# EasyEDA Pro project ProPrj_Hitboard PCB v2_center_2026-01-14.epro

# Board PCB1
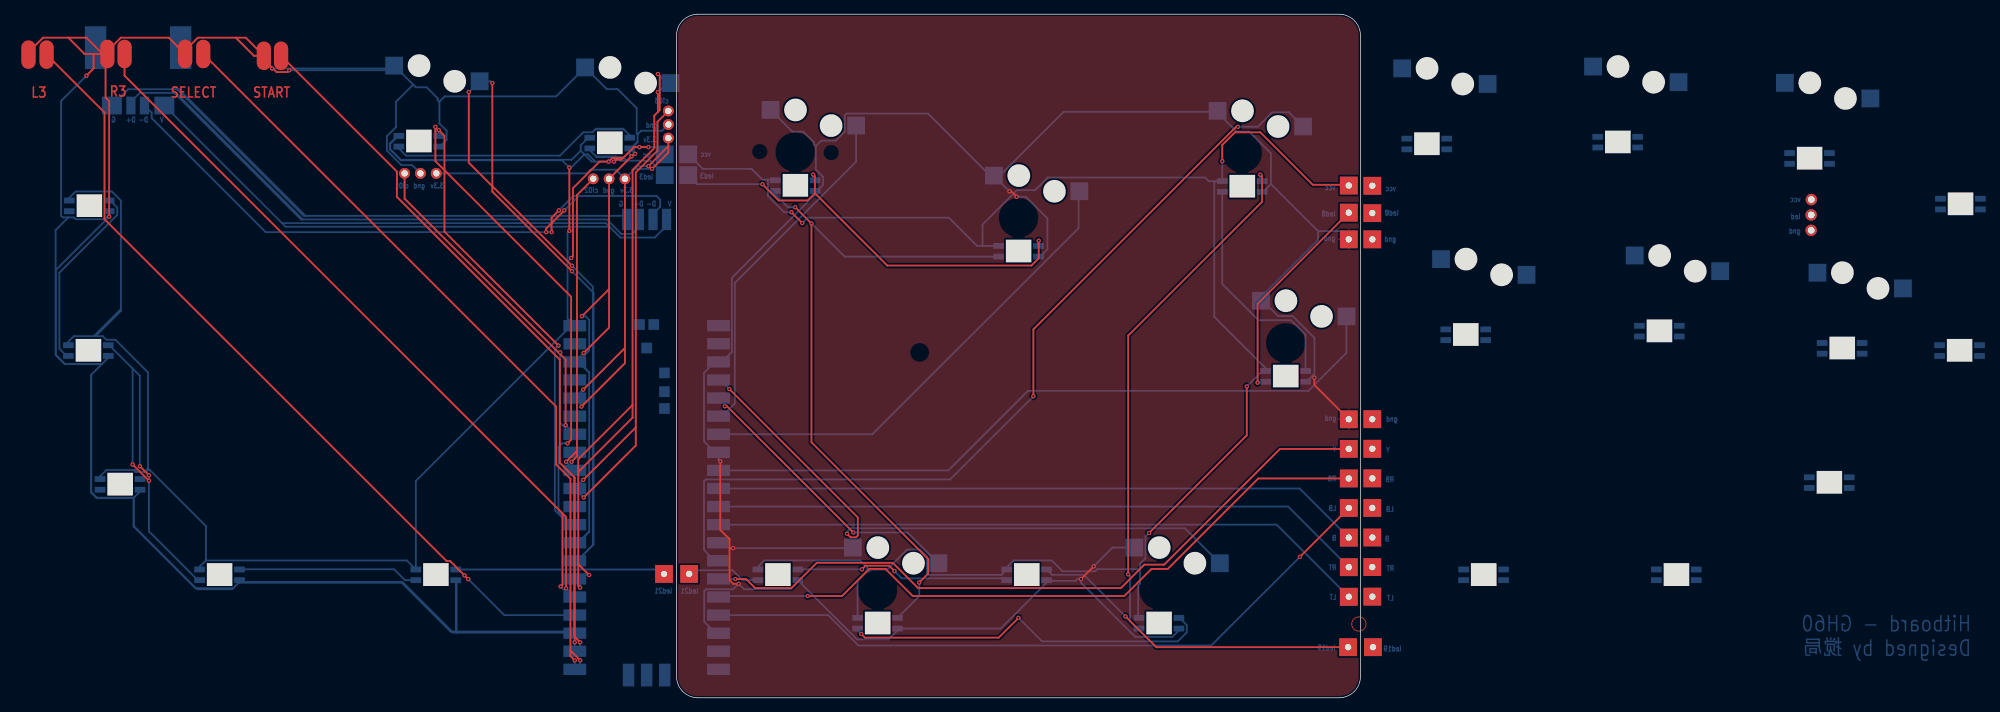
[diagram p0: board, top side]
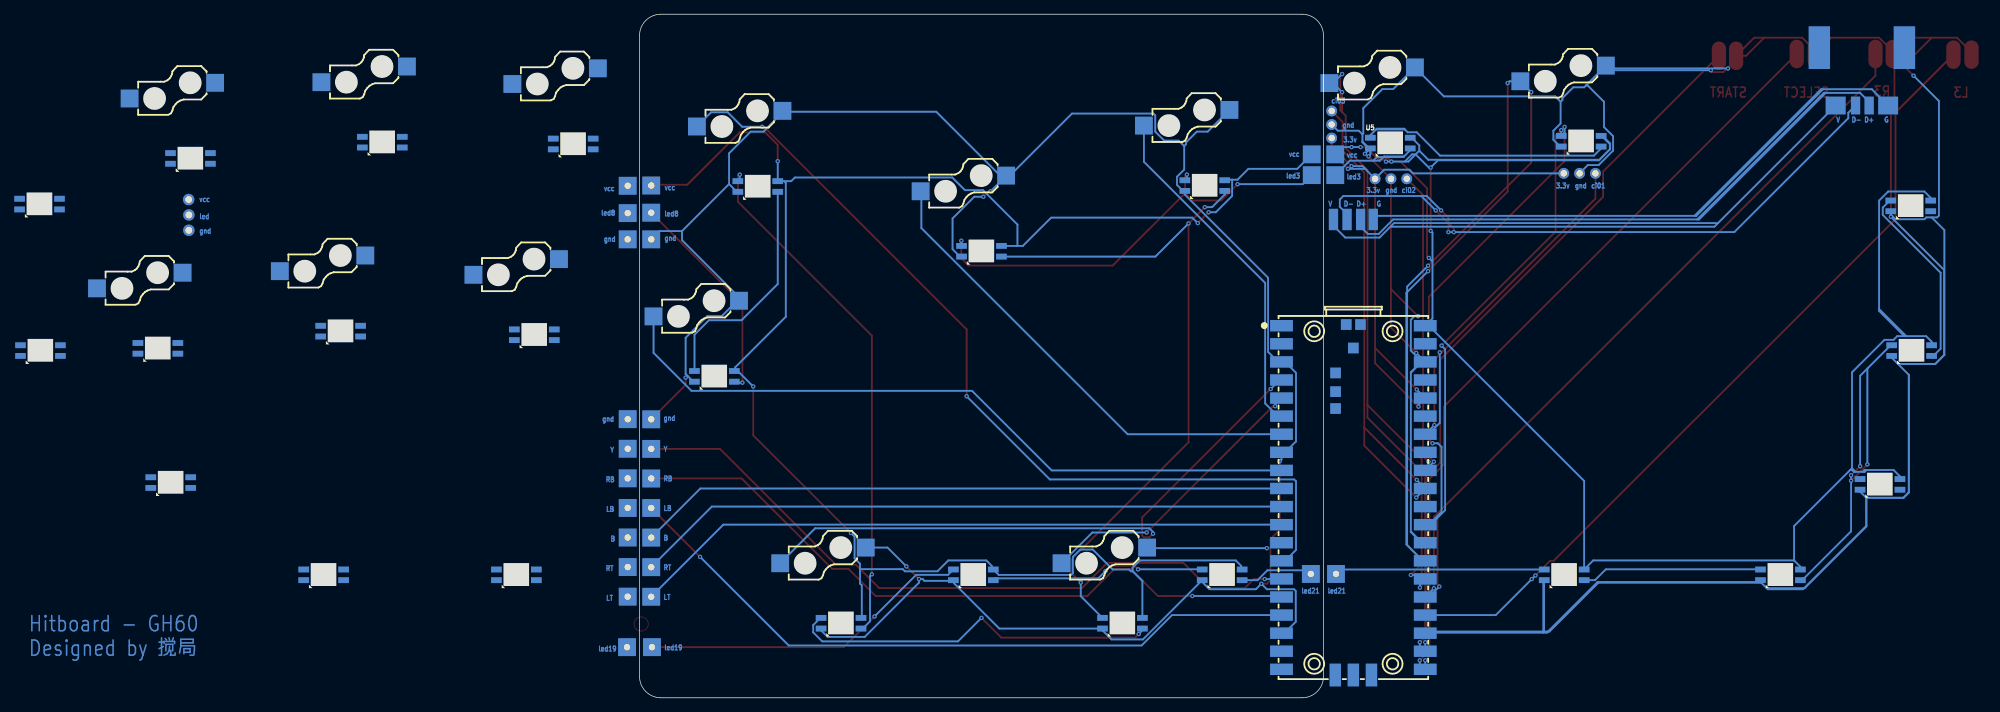
[diagram p1: board, bottom side, seen from below]

Outline 266.36 x 96 mm; copper layers: Top Layer, Bottom Layer. Coordinates in mm from the lower left corner of the outline.
Outline path: 84.34,93 84.34,3 arc(85.22,0.88) 87.34,0 177.34,0 arc(179.46,0.88) 180.34,3 180.34,93 arc(179.46,95.12) 177.34,96 87.34,96 arc(85.22,95.12) 84.34,93
Stack: Top Layer 0.035mm / Dielectric1 1.51mm FR4 er 4.5 / Bottom Layer 0.035mm

## Design rules (mm)
template: JLCPCB Capability(Two Layers Board)
spacing copperThickness1oz (default): track to track 0.102, other pairs 0.152 to 0.3
spacing copperThickness2oz: track to track 0.203, other pairs 0.152 to 0.3
track width copperThickness1oz (default): min 0.127, default 0.254, max 2.54
track width copperThickness2oz: min 0.203, default 0.254, max 2.54
differential pair differentialPair (default): width min 0.127, default 0.254, max 2.54; gap min 0.152, default 0.152
via viaSize (default): diameter min 0.5, default 0.61, max 10; hole min 0.3, default 0.305, max 6.3

## Placement (name value [footprint] x y rotation side)
NOREF  -  [Pad_e53994]  14.74 91.31 180 top
NOREF#2  -  [Pad_e677]  4.45 90.42 0 top
NOREF#3  -  [Pad_e300]  83.19 80.51 0 top
NOREF#4  -  [Pad_e295]  50.62 73.65 0 top
NOREF#5  -  [Pad_e13607]  178.69 18.34 0 top
NOREF#6  -  [Pad_e682]  28.84 90.16 0 top
NOREF#7  -  [Pad_e13636]  182 64.38 0 top
NOREF#8  -  [Pad_e13604]  178.69 30.8 0 top
NOREF#9  -  [Pad_e70]  182 30.82 0 top
NOREF#10  -  [Pad_e61147]  243.59 67.81 0 top
NOREF#11  -  [Pad_e689]  77.35 67.18 180 top
NOREF#12  -  [Pad_e679]  15.37 90.42 0 top
NOREF#13  -  [Pad_e68]  182 39.13 0 top
NOREF#14  -  [Pad_e680]  17.91 90.42 0 top
NOREF#15  -  [Pad_e301]  83.19 82.42 0 top
NOREF#16  -  [Pad_e686]  12.45 83.18 180 top
NOREF#17  -  [Pad_e299]  83.19 78.61 0 top
NOREF#18  -  [Pad_e13635]  182 68.07 0 top
NOREF#19  -  [Pad_e687]  85.98 76.32 0 top
NOREF#20  -  [Pad_e6736]  82.68 76.32 0 top
NOREF#21  -  [Pad_e53995]  2.8 91.31 180 top
NOREF#22  -  [Pad_e4877]  178.59 7.11 0 top
NOREF#23  -  [Pad_e13606]  178.69 22.49 0 top
NOREF#24  -  [Pad_e114539]  178.69 39.11 0 top
NOREF#25  -  [Pad_e675]  -6.62 90.33 0 top
NOREF#26  -  [Pad_e294]  74.87 72.89 0 top
NOREF#27  -  [Pad_e681]  26.42 90.16 0 top
NOREF#28  -  [Pad_e685]  9.66 83.18 180 top
NOREF#29  -  [Pad_e676]  -4.08 90.33 0 top
NOREF#30  -  [Pad_e61146]  243.62 69.97 0 top
NOREF#31  -  [Pad_e693]  81.03 67.18 180 top
NOREF#32  -  [Pad_e71]  182 26.66 0 top
NOREF#33  -  [Pad_e72]  182 22.51 0 top
NOREF#34  -  [Pad_e678]  6.86 90.42 0 top
NOREF#35  -  [Pad_e69]  182 34.97 0 top
NOREF#36  -  [Pad_e297]  46.17 73.65 0 top
NOREF#37  -  [Pad_e13602]  178.69 64.38 0 top
NOREF#38  -  [Pad_e684]  7.75 83.18 180 top
NOREF#39  -  [Pad_e74]  182 14.2 0 top
NOREF#40  -  [Pad_e296]  48.39 73.65 0 top
NOREF#41  -  [Pad_e694]  82.94 67.18 180 top
NOREF#42  -  [Pad_e4875]  182.09 7.11 0 top
NOREF#43  -  [Pad_e4881]  86.11 17.39 0 top
NOREF#44  -  [Pad_e6738]  82.68 73.4 0 top
NOREF#45  -  [Pad_e13603]  178.69 34.96 0 top
NOREF#46  -  [Pad_e691]  79.13 67.18 180 top
NOREF#47  -  [Pad_e6737]  85.98 73.4 0 top
NOREF#48  -  [Pad_e13605]  178.69 26.65 0 top
NOREF#49  -  [Pad_e13637]  182 71.91 0 top
NOREF#50  -  [Pad_e13608]  178.69 14.19 0 top
NOREF#51  -  [Pad_e73]  182 18.36 0 top
NOREF#52  -  [Pad_e46]  77.09 72.89 0 top
NOREF#53  -  [Pad_e13600]  178.69 71.94 0 top
NOREF#54  -  [Pad_e683]  5.09 83.18 180 top
NOREF#55  -  [Pad_e13601]  178.69 68.13 0 top
NOREF#56  -  [Pad_e61148]  243.59 65.65 0 top
NOREF#57  -  [Pad_e4879]  82.58 17.39 0 top
NOREF#58  -  [Pad_e48]  72.65 72.89 0 top
U1  PICO  [COMM-SMD_L51.0-W21.0-P2.54_SC0916]  80.14 27.81 270 bottom
U5  -  [LED-SMD_L3.2-W2.8_YO-WS2812B-3528]  132.34 62.71 180 bottom
U5#2  -  [LED-SMD_L3.2-W2.8_YO-WS2812B-3528]  264.55 69.34 180 bottom
U5#3  -  [LED-SMD_L3.2-W2.8_YO-WS2812B-3528]  264.42 48.76 180 bottom
U5#4  -  [LED-SMD_L3.2-W2.8_YO-WS2812B-3528]  246.13 30.22 180 bottom
U5#5  -  [LED-SMD_L3.2-W2.8_YO-WS2812B-3528]  197.62 17.27 180 bottom
U5#6  -  [LED-SMD_L3.2-W2.8_YO-WS2812B-3528]  133.48 17.27 180 bottom
U5#7  -  [LED-SMD_L3.2-W2.8_YO-WS2812B-3528]  98.56 17.27 180 bottom
U5#8  -  [LED-SMD_L3.2-W2.8_YO-WS2812B-3528]  50.55 17.27 180 bottom
U5#9  -  [LED-SMD_L3.2-W2.8_YO-WS2812B-3528]  20.2 17.27 180 bottom
U5#10  -  [LED-SMD_L3.2-W2.8_YO-WS2812B-3528]  1.78 48.76 180 bottom
U5#11  -  [LED-SMD_L3.2-W2.8_YO-WS2812B-3528]  1.91 69.08 180 bottom
U5#12  -  [LED-SMD_L3.2-W2.8_YO-WS2812B-3528]  6.23 29.97 180 bottom
U5#13  -  [LED-SMD_L3.2-W2.8_YO-WS2812B-3528]  224.67 17.27 180 bottom
U5#14  -  [LED-SMD_L3.2-W2.8_YO-WS2812B-3528]  48.17 78.16 180 bottom
U5#15  -  [LED-SMD_L3.2-W2.8_YO-WS2812B-3528]  74.96 77.91 180 bottom
U5#16  -  [LED-SMD_L3.2-W2.8_YO-WS2812B-3528]  101 71.94 180 bottom
U5#17  -  [LED-SMD_L3.2-W2.8_YO-WS2812B-3528]  112.56 10.47 180 bottom
U5#18  -  [LED-SMD_L3.2-W2.8_YO-WS2812B-3528]  152.05 10.47 180 bottom
U5#19  -  [LED-SMD_L3.2-W2.8_YO-WS2812B-3528]  163.74 71.81 180 bottom
U5#20  -  [LED-SMD_L3.2-W2.8_YO-WS2812B-3528]  169.83 45.14 180 bottom
U5#21  -  [LED-SMD_L3.2-W2.8_YO-WS2812B-3528]  189.64 77.78 180 bottom
U5#22  -  [LED-SMD_L3.2-W2.8_YO-WS2812B-3528]  195.11 50.98 180 bottom
U5#23  -  [LED-SMD_L3.2-W2.8_YO-WS2812B-3528]  216.44 78.03 180 bottom
U5#24  -  [LED-SMD_L3.2-W2.8_YO-WS2812B-3528]  222.28 51.49 180 bottom
U5#25  -  [LED-SMD_L3.2-W2.8_YO-WS2812B-3528]  243.37 75.75 180 bottom
U5#26  -  [LED-SMD_L3.2-W2.8_YO-WS2812B-3528]  247.94 49.08 180 bottom
U6  -  [CONN-SMD_HOTPLUGPAKAGE__C9900010116-1]  103.54 81.46 180 bottom
U6#2  -  [CONN-SMD_HOTPLUGPAKAGE__C9900010116-1]  134.88 72.24 180 bottom
U6#3  -  [CONN-SMD_HOTPLUGPAKAGE__C9900010116-1]  50.71 87.68 180 bottom
U6#4  -  [CONN-SMD_HOTPLUGPAKAGE__C9900010116-1]  77.5 87.43 180 bottom
U6#5  -  [CONN-SMD_HOTPLUGPAKAGE__C9900010116-1]  115.1 19.99 180 bottom
U6#6  -  [CONN-SMD_HOTPLUGPAKAGE__C9900010116-1]  154.59 19.99 180 bottom
U6#7  -  [CONN-SMD_HOTPLUGPAKAGE__C9900010116-1]  166.28 81.33 180 bottom
U6#8  -  [CONN-SMD_HOTPLUGPAKAGE__C9900010116-1]  172.37 54.66 180 bottom
U6#9  -  [CONN-SMD_HOTPLUGPAKAGE__C9900010116-1]  192.18 87.3 180 bottom
U6#10  -  [CONN-SMD_HOTPLUGPAKAGE__C9900010116-1]  197.65 60.51 180 bottom
U6#11  -  [CONN-SMD_HOTPLUGPAKAGE__C9900010116-1]  218.98 87.56 180 bottom
U6#12  -  [CONN-SMD_HOTPLUGPAKAGE__C9900010116-1]  224.82 61.01 180 bottom
U6#13  -  [CONN-SMD_HOTPLUGPAKAGE__C9900010116-1]  245.91 85.27 180 bottom
U6#14  -  [CONN-SMD_HOTPLUGPAKAGE__C9900010116-1]  250.48 58.6 180 bottom

## Footprints (pads in the part's own frame, mm; a bottom-side part is the same pattern mirrored in y, then rotated)
COMM-SMD_L51.0-W21.0-P2.54_SC0916
  rect 1.6x3.2 smd: 1(-24.445,-10.088) 2(-21.905,-10.088) 3(-19.365,-10.088) 4(-16.825,-10.088) 5(-14.285,-10.088) 6(-11.745,-10.088) 7(-9.205,-10.088) 8(-6.665,-10.088) 9(-4.125,-10.088) 10(-1.585,-10.088) 11(0.955,-10.088) 12(3.495,-10.088) 13(6.035,-10.088) 14(8.575,-10.088) 15(11.115,-10.088) 16(13.655,-10.088) 17(16.195,-10.088) 18(18.735,-10.088) 19(21.275,-10.088) 20(23.815,-10.088) 21(23.815,10.088) 22(21.275,10.088) 23(18.735,10.088) 24(16.195,10.088) 25(13.655,10.088) 26(11.115,10.088) 27(8.575,10.088) 28(6.035,10.088) 29(3.495,10.088) 30(0.955,10.088) 31(-1.585,10.088) 32(-4.125,10.088) 33(-6.665,10.088) 34(-9.205,10.088) 35(-11.745,10.088) 36(-14.285,10.088) 37(-16.825,10.088) 38(-19.365,10.088) 39(-21.905,10.088) 40(-24.445,10.088)
  rect 3.2x1.6 smd: 41(24.615,-2.54) 42(24.615,0) 43(24.615,2.54)
  rect 1.5x1.5 smd: TP1(-21.315,0) TP2(-24.615,1) TP3(-24.615,-1) TP4(-17.815,-2.5) TP5(-15.188,-2.5) TP6(-12.815,-2.5)
CONN-SMD_HOTPLUGPAKAGE__C9900010116-1
  rect 2.5x2.5 smd: 1(-6,-1.1) 2(6,1.1)
LED-SMD_L3.2-W2.8_YO-WS2812B-3528
  rect 1.5x0.82 smd: 1(2.8,0.75) 2(2.8,-0.75) 3(-2.8,-0.75) 4(-2.8,0.75)
Pad_e46
  round 1.524 hole 0.914: 1(0,0)
Pad_e48
  round 1.524 hole 0.914: 1(0,0)
Pad_e68
  rect 2.5x2.5 hole 0.9: PTH(0,0)
Pad_e69
  rect 2.5x2.5 hole 0.9: PTH(0,0)
Pad_e70
  rect 2.5x2.5 hole 0.9: PTH(0,0)
Pad_e71
  rect 2.5x2.5 hole 0.9: PTH(0,0)
Pad_e72
  rect 2.5x2.5 hole 0.9: PTH(0,0)
Pad_e73
  rect 2.5x2.5 hole 0.9: PTH(0,0)
Pad_e74
  rect 2.5x2.5 hole 0.9: PTH(0,0)
Pad_e294
  round 1.524 hole 0.914: 1(0,0)
Pad_e295
  round 1.524 hole 0.914: 1(0,0)
Pad_e296
  round 1.524 hole 0.914: 1(0,0)
Pad_e297
  round 1.524 hole 0.914: 1(0,0)
Pad_e299
  round 1.524 hole 0.914: 1(0,0)
Pad_e300
  round 1.524 hole 0.914: 1(0,0)
Pad_e301
  round 1.524 hole 0.914: 1(0,0)
Pad_e675
  oval 2x4 smd: 1(0,0)
Pad_e676
  oval 2x4 smd: 1(0,0)
Pad_e677
  oval 2x4 smd: 1(0,0)
Pad_e678
  oval 2x4 smd: 1(0,0)
Pad_e679
  oval 2x4 smd: 1(0,0)
Pad_e680
  oval 2x4 smd: 1(0,0)
Pad_e681
  oval 2x4 smd: 1(0,0)
Pad_e682
  oval 2x4 smd: 1(0,0)
Pad_e683
  rect 2.8x2.5 smd far side: PTH(0,0)
Pad_e684
  rect 1.3x2.5 smd far side: PTH(0,0)
Pad_e685
  rect 1.3x2.5 smd far side: PTH(0,0)
Pad_e686
  rect 2.8x2.5 smd far side: PTH(0,0)
Pad_e687
  rect 2.5x2.5 smd far side: PTH(0,0)
Pad_e689
  rect 1.3x3 smd far side: PTH(0,0)
Pad_e691
  rect 1.3x3 smd far side: PTH(0,0)
Pad_e693
  rect 1.3x3 smd far side: PTH(0,0)
Pad_e694
  rect 1.3x3 smd far side: PTH(0,0)
Pad_e4875
  rect 2.5x2.5 hole 0.9: PTH(0,0)
Pad_e4877
  rect 2.5x2.5 hole 0.9: PTH(0,0)
Pad_e4879
  rect 2.5x2.5 hole 0.9: PTH(0,0)
Pad_e4881
  rect 2.5x2.5 hole 0.9: PTH(0,0)
Pad_e6736
  rect 2.5x2.5 smd far side: PTH(0,0)
Pad_e6737
  rect 2.5x2.5 smd far side: PTH(0,0)
Pad_e6738
  rect 2.5x2.5 smd far side: PTH(0,0)
Pad_e13600
  rect 2.5x2.5 hole 0.9: PTH(0,0)
Pad_e13601
  rect 2.5x2.5 hole 0.9: PTH(0,0)
Pad_e13602
  rect 2.5x2.5 hole 0.9: PTH(0,0)
Pad_e13603
  rect 2.5x2.5 hole 0.9: PTH(0,0)
Pad_e13604
  rect 2.5x2.5 hole 0.9: PTH(0,0)
Pad_e13605
  rect 2.5x2.5 hole 0.9: PTH(0,0)
Pad_e13606
  rect 2.5x2.5 hole 0.9: PTH(0,0)
Pad_e13607
  rect 2.5x2.5 hole 0.9: PTH(0,0)
Pad_e13608
  rect 2.5x2.5 hole 0.9: PTH(0,0)
Pad_e13635
  rect 2.5x2.5 hole 0.9: PTH(0,0)
Pad_e13636
  rect 2.5x2.5 hole 0.9: PTH(0,0)
Pad_e13637
  rect 2.5x2.5 hole 0.9: PTH(0,0)
Pad_e53994
  rect 3x6 smd far side: PTH(0,0)
Pad_e53995
  rect 3x6 smd far side: PTH(0,0)
Pad_e61146
  round 1.6 hole 0.96: PTH(0,0)
Pad_e61147
  round 1.6 hole 0.96: PTH(0,0)
Pad_e61148
  round 1.6 hole 0.96: PTH(0,0)
Pad_e114539
  rect 2.5x2.5 hole 0.9: PTH(0,0)

## Nets
3V3: NOREF#4.1 NOREF#17.1 NOREF#52.1 U1.36
GND: NOREF#2.1 NOREF#3.1 NOREF#7.PTH NOREF#12.1 NOREF#13.PTH NOREF#24.PTH NOREF#25.1 NOREF#26.1 NOREF#27.1 NOREF#37.PTH NOREF#40.1 NOREF#56.PTH U1.3 U1.8 U1.18 U1.23 U1.28 U1.38 U5.3 U5#2.3 U5#3.3 U5#4.3 U5#5.3 U5#6.3 U5#7.3 U5#8.3 U5#9.3 U5#10.3 U5#11.3 U5#12.3 U5#13.3 U5#14.3 U5#15.3 U5#16.3 U5#17.3 U5#18.3 U5#19.3 U5#20.3 U5#21.3 U5#22.3 U5#23.3 U5#24.3 U5#25.3 U5#26.3 U6.2 U6#2.2 U6#3.2 U6#4.2 U6#5.2 U6#6.2 U6#7.2 U6#8.2 U6#9.2 U6#10.2 U6#11.2 U6#12.2 U6#13.2 U6#14.2
VCC: NOREF#19.PTH NOREF#20.PTH NOREF#30.PTH NOREF#49.PTH NOREF#53.PTH U1.40 U5.1 U5#2.1 U5#3.1 U5#4.1 U5#5.1 U5#6.1 U5#7.1 U5#8.1 U5#9.1 U5#10.1 U5#11.1 U5#12.1 U5#13.1 U5#14.1 U5#15.1 U5#16.1 U5#17.1 U5#18.1 U5#19.1 U5#20.1 U5#21.1 U5#22.1 U5#23.1 U5#24.1 U5#25.1 U5#26.1
2: U5#14.2 U5#15.4
3: NOREF#44.PTH NOREF#47.PTH U5.4 U5#15.2 U5#16.4
4: U5.2 U5#16.2 U5#17.4
5: U5#17.2 U5#18.4
6: U5#18.2 U5#19.4
7: U5#19.2 U5#20.4
8: NOREF#18.PTH NOREF#55.PTH U5#20.2 U5#21.4
9: U5#21.2 U5#22.4
10: U5#22.2 U5#23.4
11: U5#23.2 U5#24.4
12: U5#24.2 U5#25.4
13: U5#25.2 U5#26.4
14: NOREF#10.PTH U5#2.4 U5#12.4 U5#26.2
15: U5#2.2 U5#3.4 U5#12.2
16: U5#3.2 U5#4.4
17: U5#4.2 U5#13.4
18: U5#5.4 U5#13.2
19: NOREF#22.PTH NOREF#42.PTH U5#5.2 U5#6.4
20: U5#6.2 U5#7.4
21: NOREF#43.PTH NOREF#57.PTH U5#7.2 U5#8.4
22: U5#8.2 U5#9.4
23: U5#9.2 U5#10.4
24: U5#10.2 U5#11.4
25: U5#11.2
A: U1.9 U6#8.1
B: NOREF#23.PTH NOREF#33.PTH U1.10 U6#10.1
BUTTON1: U1.5 U6#5.1
BUTTON2: U1.7 U6#2.1
D+: NOREF#38.PTH NOREF#46.PTH
D-: NOREF#28.PTH NOREF#31.PTH
DOWN: U1.26 U6#4.1
G: NOREF#11.PTH NOREF#54.PTH
L3: NOREF#29.1 U1.24
LB: NOREF#32.PTH NOREF#48.PTH U1.17 U6#13.1
LED1: U1.29 U5#14.4
LEFT: U1.27 U6#3.1
LINEBUTTON01: NOREF#36.1 U1.34
LINEBUTTON02: NOREF#58.1 U1.32
LINEBUTTON03: NOREF#15.1 U1.31
LT: NOREF#39.PTH NOREF#50.PTH U1.12 U6#14.1
R3: NOREF#34.1 U1.25
RB: NOREF#8.PTH NOREF#9.PTH U1.16 U6#11.1
RIGHT: U1.6 U6.1
RT: NOREF#5.PTH NOREF#51.PTH U1.11 U6#12.1
SELECT: NOREF#14.1 U1.21
START: NOREF#6.1 U1.22
UP: U1.4 U6#6.1
V: NOREF#16.PTH NOREF#41.PTH
X: U1.14 U6#7.1
Y: NOREF#35.PTH NOREF#45.PTH U1.15 U6#9.1

Pads without a net: NOREF PTH; NOREF#21 PTH; U1 1 2 13 19 20 30 33 35 37 39 41 42 43 TP1 TP2 TP3 TP4 TP5 TP6

## Via types
v1: diameter 0.61, hole 0.305, Top Layer to Bottom Layer, 89 vias

## Routing (per net, layer and track width the routed paths; a pad name or vN(x,y) marks a point on that pad's centre or on a via; arc(x,y) is an arc through that point)
3V3: length 89
  Top Layer w0.254: 83.19,77.46 83.19,76.58 v1(80.91,74.29) ; 83.19,77.46 NOREF#17.1 ; 83.19,77.46 v1(80.4,74.67) ; NOREF#52.1 77.09,49.13 ; 77.09,49.13 77.09,46.98 v1(71,40.89) ; 77.09,49.13 v1(71.25,43.29)
  Bottom Layer w0.254: v1(71.25,43.29) U1.36 71,41.15 v1(71,40.89) ; v1(80.4,74.67) 78.87,74.67 78.49,74.29 ; 78.49,74.29 v1(80.91,74.29) ; 78.49,74.29 NOREF#52.1 75.83,74.16 72.27,74.16 71.76,73.65 NOREF#4.1
GND: length 916
  Top Layer w0.254: 2.53,90.42 2.53,88.39 v1(1.51,87.37) ; 2.53,90.42 3.8,90.42 ; 2.53,90.42 1.26,90.42 -1.03,92.7 ; -1.03,92.7 -4.58,92.7 -6.62,90.67 NOREF#25.1 ; -1.03,92.7 1.51,92.7 3.8,90.42 ; v1(173.87,44.97) 173.87,43.94 NOREF#24.PTH ; 91.78,21.01 91.78,16.52 92.29,16.01 v1(93.05,16.01) ; 91.78,21.01 91.78,22.28 90.48,23.58 v1(90.48,33.2) ; 91.78,21.01 v1(92.29,21.01) ; 3.8,90.42 4.31,90.42 ; 26.3,90.16 NOREF#27.1 ; 26.3,90.16 26.3,89.66 v1(27.57,88.39) ; 26.3,90.16 25.03,90.16 22.48,92.7 ; NOREF#27.1 23.88,92.7 22.48,92.7 ; NOREF#27.1 26.42,89.66 28.2,87.88 29.72,87.88 v1(29.98,88.13) ; v1(132.08,70.37) 131.32,71.13 v1(131.07,71.13) ; v1(141.11,16.68) v1(142.89,18.45) ; 74.87,57.4 NOREF#26.1 v1(78.02,76.04) 78.37,76.39 v1(78.53,76.39) ; 74.87,57.4 v1(71.06,53.59) ; 74.87,57.4 74.87,51.99 v1(71.32,48.43) ; 4.31,90.42 NOREF#2.1 4.2,90.16 4.2,84.32 4.71,83.81 v1(4.71,67.56) ; 4.31,90.42 4.31,90.67 6.34,92.7 13.09,92.7 NOREF#12.1 15.37,90.93 17.15,92.7 22.48,92.7
  Bottom Layer w0.254: U5.3 135.28,62.11 135.5,62.11 136.4,63 136.4,67.32 133.35,70.37 v1(132.08,70.37) ; 101.36,16.26 101.61,16.26 109.68,8.19 114.09,8.19 115.27,9.38 115.27,9.63 U5#17.3 129.83,9.72 136.18,16.07 136.18,16.32 136.28,16.42 ; 101.36,16.26 U5#7.3 ; 101.36,16.26 100.34,15.25 93.82,15.25 v1(93.05,16.01) 92.29,15.25 88.48,15.25 88.23,14.99 88.23,10.67 89.83,9.07 U1.18 ; v1(92.29,21.01) 109.01,21.01 U6#5.2 ; 160.15,82.31 162.94,79.51 164.72,79.51 167.77,76.47 167.77,72.15 ; 160.15,82.31 U6#7.2 ; 160.15,82.31 138.69,82.31 129.54,73.16 129.54,72.66 ; 22.13,15.4 22.9,16.16 ; 22.13,15.4 21.98,15.25 17.02,15.25 16.87,15.4 ; 22.13,15.4 16.87,15.4 ; 22.9,16.16 45.76,16.16 52.61,9.3 52.82,9.3 ; 22.9,16.16 22.9,16.41 U5#9.3 23,16.26 ; 22.9,16.16 23,16.26 ; -2.78,48.14 -2.78,60.07 v1(4.71,67.56) 4.71,67.86 ; -2.78,48.14 -2.81,48.16 -2.81,65.69 -1.03,67.47 ; -2.78,48.14 -2.78,48.13 -1.51,46.86 3.69,46.86 ; -2.78,48.14 -1.54,46.89 3.72,46.89 ; 8.13,28.07 2.93,28.07 2.17,28.83 2.17,45.34 2.19,45.37 ; 8.13,28.07 8.16,28.1 ; 8.13,28.07 8.13,24.14 8.16,24.11 ; 166.5,55.89 166.5,56.4 174.37,64.27 174.37,65.54 ; 166.5,55.89 168.79,53.61 170.82,53.61 173.87,50.56 173.87,45.48 173.61,45.22 ; 166.5,55.89 U6#8.2 ; 52.82,9.3 45.86,16.26 23,16.26 ; 52.82,9.3 52.97,9.15 53.48,9.15 ; 52.82,9.3 53.38,9.3 ; 174.37,65.54 177.53,65.54 NOREF#37.PTH ; 174.37,65.54 167.77,72.15 ; 129.54,72.66 v1(131.07,71.13) ; 129.54,72.66 128.78,73.42 ; -1.03,67.47 -1.79,67.47 -2.04,67.72 -2.04,83.81 v1(1.51,87.37) ; -1.03,67.47 -0.27,67.47 -0.01,67.21 4.05,67.21 4.71,67.86 ; 173.61,45.22 172.78,44.39 U5#20.3 ; 173.61,45.22 v1(173.87,44.97) ; 136.28,16.42 140.35,16.42 140.6,16.68 v1(141.11,16.68) 141.11,16.17 148.73,8.55 153.94,8.55 154.85,9.46 U5#18.3 ; 136.28,16.42 U5#6.3 ; v1(78.02,76.04) 77.76,76.29 U5#15.3 ; 4.71,67.86 4.71,67.87 U5#11.3 ; 4.71,67.86 4.71,68.33 ; NOREF#40.1 47.23,74.81 45.72,74.81 43.69,76.85 43.69,78.88 44.96,80.15 44.96,83.7 47.25,85.99 47.5,85.99 ; 47.5,85.99 47.75,85.74 49.28,85.74 50.8,84.21 50.8,83.96 51.06,83.7 ; 47.5,85.99 U6#3.2 44.31,88.39 ; 53.38,16.49 U5#8.3 ; 53.38,16.49 53.48,16.39 53.48,9.3 ; 53.38,16.49 53.38,9.3 ; 78,77.25 78.11,77.25 78.87,78.01 78.87,78.12 ; 78,77.25 78.87,78.12 ; 78,77.25 77.91,77.16 U5#15.3 ; 78,77.25 77.85,77.25 U5#15.3 ; 70.48,47.24 72.08,45.64 ; 70.48,47.24 70.3,47.42 ; 70.48,47.24 70.12,47.24 ; 70.48,47.24 70.55,47.24 ; 72.08,45.64 72.08,23.36 ; 72.08,45.64 72.08,45.71 70.55,47.24 ; v1(71.32,48.43) 70.3,47.42 ; 70.3,47.42 70.12,47.24 ; 44.31,88.39 44.05,88.13 v1(29.98,88.13) ; 44.31,88.39 v1(27.57,88.39) ; 8.16,28.1 9.03,28.96 U5#12.3 ; 8.16,28.1 2.96,28.1 2.19,28.86 2.19,45.37 ; 8.16,28.1 8.16,24.11 ; U6#6.2 145.53,21.09 v1(142.89,18.45) ; 69.98,9.15 U1.23 ; 69.98,9.15 53.48,9.15 ; 69.98,9.15 69.83,9.3 53.48,9.3 ; U5#15.3 v1(78.53,76.39) ; 70.49,21.77 70.56,21.77 72.08,23.29 72.08,23.36 ; 70.49,21.77 72.08,23.36 ; 70.49,21.77 U1.28 ; 78.87,79.13 78.75,79.25 78.75,82.81 76.08,85.48 74.55,85.48 U6#4.2 67.44,84.47 51.82,84.47 51.06,83.7 ; 78.87,79.13 78.87,78.12 ; 78.87,79.13 79.38,79.64 82.32,79.64 NOREF#3.1 ; 70.12,47.24 U1.38 ; 53.48,9.3 53.48,9.15 ; 53.48,9.3 53.38,9.3 ; 3.72,46.89 4.58,47.76 U5#10.3 ; 3.72,46.89 3.69,46.86 ; 8.16,24.11 16.87,15.4 ; 8.16,24.11 8.16,24.03 16.8,15.4 16.87,15.4 ; 103.89,77.48 104.65,78.24 106.68,78.24 107.95,79.51 107.95,81.8 108.21,82.05 119.64,82.05 128.27,73.42 128.78,73.42 ; 103.89,77.48 103.89,74.18 104.9,73.16 104.9,72.04 104.14,71.28 103.89,71.28 U5#16.3 103.8,70.68 92.11,58.99 92.11,48.58 90.71,47.17 U1.3 89.72,47.17 88.2,45.65 88.2,36 89.72,34.47 U1.8 90.23,33.46 v1(90.48,33.2) ; 103.89,77.48 103.63,77.73 103.63,77.99 102.11,79.51 100.59,79.51 U6.2 ; v1(71.06,53.59) 71.57,53.59 72.08,53.08 72.08,48.76 70.55,47.24 ; 51.06,83.7 51.06,80.66 52.07,79.64 52.07,78.37 51.11,77.41 U5#14.3 ; 167.77,72.15 166.68,71.06 U5#19.3 ; 2.19,45.37 3.69,46.86 ; 128.78,73.42 U6#2.2
VCC: length 545.7
  Top Layer w0.254: v1(150.66,23.14) 164.38,36.86 v1(164.38,43.72) ; 76.84,75.81 75.32,75.81 v1(74.81,75.31) 73.54,75.31 69.8,71.57 69.8,62.02 v1(69.55,61.77) ; 76.84,75.81 76.59,75.56 75.83,75.56 v1(75.57,75.31) ; 76.84,75.81 78.37,77.34 v1(79.13,77.34) v1(80.4,77.34) ; v1(100.46,68.19) v1(101.99,66.67) ; v1(160.94,75.35) 160.94,77.64 162.71,79.42 166.27,79.42 173.64,72.05 178.58,72.05 NOREF#53.PTH ; v1(69.29,74.47) v1(69.29,65.58)
  Bottom Layer w0.254: 44.15,77.03 44.1,77.08 44.1,77.84 45.16,78.91 45.29,78.91 ; 44.15,77.03 44.15,77.77 45.29,78.91 ; 44.15,77.03 44.15,77.01 45.67,75.48 68.28,75.48 v1(69.29,74.47) 69.55,74.47 71.4,76.32 ; 44.15,77.03 45.62,75.56 69.62,75.56 70.89,76.83 ; -0.89,69.83 -0.89,70.21 0,71.1 5.08,71.1 6.35,69.83 6.35,54.59 ; 160.06,72.56 159.04,72.56 158.53,73.07 136.44,73.07 134.66,71.29 132.12,71.29 127.29,66.46 127.29,63.46 ; 160.06,72.56 159.81,72.31 159.81,53.51 166.92,46.4 166.92,46 ; 160.06,72.56 U5#19.1 v1(160.94,75.35) ; 45.29,78.91 U5#14.1 ; U5#16.1 98.12,72.77 97.16,72.77 ; 8.13,31.99 8.38,31.99 8.64,31.73 ; 8.13,31.99 8.38,31.73 8.64,31.73 ; 8.13,31.99 4.32,31.99 3.43,31.1 U5#12.1 ; 166.92,46 166.66,46 v1(164.38,43.72) ; 166.92,46 U5#20.1 ; 149.39,18.06 149.39,16.03 149.14,15.78 149.14,11.33 U5#18.1 ; 149.39,18.06 143.39,18.06 143.09,17.76 138.52,17.76 136.99,19.29 131.66,19.29 130.9,18.52 130.9,18.23 U5#6.1 129.92,17.25 119.76,17.25 119.51,17.51 119.51,19.79 118.49,20.81 116.71,20.81 113.92,18.02 111.63,18.02 111.38,17.76 111.12,17.76 ; 149.39,18.06 149.39,18.83 150.15,19.59 150.15,22.64 v1(150.66,23.14) ; U5#17.1 109.76,16.39 111.12,17.76 ; 69.04,61.26 69.04,53.27 U1.40 69.55,52.25 47.75,30.46 U5#8.1 46.48,19.29 18.29,19.29 ; 69.04,61.26 v1(69.55,61.77) ; 69.04,61.26 69.04,65.32 v1(69.29,65.58) ; 10.41,31.99 18.29,24.11 18.29,19.29 ; 10.41,31.99 10.16,31.99 ; 10.41,31.99 10.16,32.24 ; 9.65,31.73 9.91,31.73 10.16,31.99 ; 9.65,31.73 10.16,32.24 ; 9.65,31.73 8.64,31.73 ; 127.29,63.46 126.53,63.46 122.56,67.43 102.75,67.43 v1(101.99,66.67) ; 127.29,63.46 U5.1 ; 97.16,72.77 96.4,72.77 94.88,74.29 88.02,74.29 NOREF#19.PTH ; 97.16,72.77 97.16,70.48 99.45,68.19 v1(100.46,68.19) ; 2.54,50.78 -0.25,50.78 -1.02,50.02 U5#10.1 ; 2.54,50.78 6.35,54.59 ; 2.54,50.78 2.79,50.78 ; v1(79.13,77.34) v1(80.4,77.34) 81.67,77.34 NOREF#20.PTH ; 72.93,75.31 72.42,75.31 71.4,76.32 ; 72.93,75.31 71.91,76.32 71.4,76.32 ; 72.93,75.31 v1(74.81,75.31) v1(75.57,75.31) ; 111.12,17.76 111.12,18.27 110.11,19.29 96.65,19.29 95.89,18.52 95.89,18.14 U5#7.1 ; U5#9.1 17.4,18.4 18.29,19.29 ; 71.4,76.32 70.89,76.83 ; 70.89,76.83 70.89,77.59 71.79,78.49 ; 6.35,54.59 6.35,54.34 2.79,50.78 ; 10.16,31.99 10.16,32.24 ; 10.16,32.24 10.16,45.7 5.59,50.27 4.32,50.27 3.81,50.78 2.79,50.78 ; 71.79,78.49 71.96,78.66 U5#15.1 72,78.49 71.79,78.49
2: length 39.4
  Bottom Layer w0.254: U5#14.2 45.37,77.16 46.38,76.14 67.97,76.14 71.25,79.42 72.52,79.42 72.93,79.83 ; 72.93,79.83 73.03,79.92 76.84,79.92 76.94,79.83 ; 72.93,79.83 76.94,79.83 ; 76.94,79.83 77.76,79 U5#15.4
3: length 79.4
  Top Layer w0.254: 103.77,70.86 113.92,60.7 134.16,60.7 135.17,61.72 v1(135.17,64.19) ; 103.77,70.86 102.75,69.84 98.69,69.84 v1(96.4,72.13) ; 103.77,70.86 103.77,73.23 v1(103.51,73.48)
  Bottom Layer w0.254: 77.35,75.43 76.43,75.43 75.92,75.94 ; 77.35,75.43 76.84,75.94 75.92,75.94 ; 77.35,75.43 80.65,75.43 NOREF#44.PTH ; U5.4 135.17,63.49 v1(135.17,64.19) ; 75.92,75.94 75.83,76.03 73.03,76.03 ; 75.92,75.94 73.12,75.94 73.03,76.03 ; v1(103.51,73.48) 103.51,72.97 U5#16.4 ; NOREF#47.PTH 87.26,72.13 v1(96.4,72.13) ; 73.03,76.03 72.16,76.9 U5#15.2
4: length 99.4
  Top Layer w0.254: v1(118.4,16.18) 119.67,17.45 119.67,19.49 103.28,35.88 v1(103.28,66.61) v1(100.99,68.9)
  Bottom Layer w0.254: U5#16.2 98.2,70.68 99.98,68.9 v1(100.99,68.9) ; v1(103.28,66.61) 107.93,61.96 U5.2 ; v1(118.4,16.18) 118.4,14.27 U5#17.4
5: length 52.5
  Top Layer w0.254: v1(110.26,8.96) 110.77,8.45 129.57,8.45 v1(132.34,11.22)
  Bottom Layer w0.254: v1(110.26,8.96) 109.76,9.46 U5#17.2 ; U5#18.4 154.94,11.22 155.96,10.2 155.96,9.19 154.69,7.92 135.64,7.92 v1(132.34,11.22)
6: length 73.4
  Top Layer w0.254: v1(147.73,17.34) 147.73,50.87 166.52,69.66 166.52,73.22 v1(166.27,73.47)
  Bottom Layer w0.254: v1(166.27,73.47) 166.27,72.83 U5#19.4 ; U5#18.2 149,9.72 147.98,10.73 147.98,17.08 v1(147.73,17.34)
7: length 32.7
  Bottom Layer w0.254: U5#19.2 160.94,58.11 166.02,53.03 170.59,53.03 172.62,50.99 172.62,45.9 U5#20.4
8: length 30.4
  Top Layer w0.254: NOREF#55.PTH 165.9,55.33 v1(165.9,44.25)
  Bottom Layer w0.254: U5#20.2 166.9,44.25 v1(165.9,44.25)
19: length 46.8
  Top Layer w0.254: NOREF#22.PTH 151.67,7.11 v1(147.35,11.42)
  Bottom Layer w0.254: v1(147.35,11.42) 141.51,17.27 137.03,17.27 U5#6.4
20: length 30.4
  Top Layer w0.254: v1(110.36,18.04) 110.87,18.55 114.17,18.55 v1(114.94,17.79)
  Bottom Layer w0.254: v1(114.94,17.79) 115.95,16.77 130.43,16.77 U5#6.2 ; U5#7.4 101.38,18.04 v1(110.36,18.04)
21: length 39.9
  Bottom Layer w0.254: NOREF#43.PTH 86.62,17.9 92.21,17.9 93.59,16.52 U5#7.2 ; NOREF#57.PTH 81.96,18.02 U5#8.4
22: length 25.4
  Bottom Layer w0.254: U5#8.2 46.23,16.52 44.7,18.04 23.02,18.04 U5#9.4
23: length 55.2
  Top Layer w0.254: v1(10.29,30.49) v1(8,32.77) ; v1(10.29,31.25) v1(9.02,32.52)
  Bottom Layer w0.254: v1(8,32.77) 8,46.23 ; 8,46.23 4.82,49.42 4.68,49.42 U5#10.4 ; 8,46.23 9.02,45.22 v1(9.02,32.52) ; v1(10.29,31.25) v1(10.29,30.49) 10.29,23.37 17.15,16.52 U5#9.2
24: length 26.4
  Bottom Layer w0.254: U5#11.4 4.81,69.74 4.94,69.74 5.84,68.84 5.84,67.82 -2.29,59.7 -2.29,49.03 -1.27,48.01 U5#10.2
A: length 100.1
  Bottom Layer w0.254: 178.37,53.56 178.37,48.44 173.03,43.11 133.66,43.11 122.49,31.93 U1.9
B: length 91.3
  Bottom Layer w0.254: NOREF#23.PTH 171.8,29.39 U1.10
BUTTON1: length 40.6
  Top Layer w0.254: v1(91.12,40.94) 91.42,40.94 v1(109.16,23.21)
  Bottom Layer w0.254: U1.5 91.12,41.2 v1(91.12,40.94) ; U6#5.1 116.78,23.21 v1(109.16,23.21)
BUTTON2: length 67.8
  Bottom Layer w0.254: U1.7 111.82,37.01 140.78,65.97 140.78,71.03 U6#2.1
D+: length 107.5
  Bottom Layer w0.254: 31.88,67.18 74.56,67.18 76.59,65.14 78.11,65.14 79.13,66.16 NOREF#46.PTH ; 31.88,67.18 31.63,67.18 13.85,84.96 ; 31.88,67.18 14.1,84.96 13.85,84.96 ; 13.85,84.96 9.02,84.96 7.75,83.69 NOREF#38.PTH
D-: length 93.9
  Top Layer w0.254: 66.81,66.67 v1(68.59,68.45) ; 66.81,66.67 66.81,67.43 v1(67.82,68.45) ; 66.81,66.67 v1(66.81,65.4) ; 66.81,66.67 66.05,65.91 v1(66.05,65.4)
  Bottom Layer w0.254: NOREF#31.PTH 81.03,67.94 82.05,68.95 82.05,69.97 81.54,70.48 70.62,70.48 ; v1(67.82,68.45) 69.86,70.48 70.62,70.48 ; NOREF#28.PTH 10.67,82.16 10.67,81.4 26.68,65.4 v1(66.05,65.4) v1(66.81,65.4) ; v1(68.59,68.45) 70.62,70.48
DOWN: length 102.5
  Top Layer w0.254: 81.73,82.27 81.98,82.52 81.98,87.35 v1(81.73,87.6) ; 81.73,82.27 81.22,81.76 81.22,77.19 78.17,74.14 78.17,41.12 ; 81.73,82.27 v1(81.73,85.06) ; 78.17,41.12 70.55,33.5 70.55,31.72 ; 78.17,41.12 78.17,39.34 70.55,31.72 ; 70.55,18.77 v1(72.07,17.24) ; 70.55,18.77 70.55,15.72 v1(70.8,15.46) ; 70.55,18.77 70.55,31.72
  Bottom Layer w0.254: 83,86.33 v1(81.73,85.06) ; 83,86.33 v1(81.73,87.6) ; 83,86.33 U6#4.1 ; v1(70.8,15.46) 70.8,15.94 U1.26 70.61,17.24 v1(72.07,17.24)
G: length 106.2
  Bottom Layer w0.254: 14.23,85.47 32.01,67.69 32.26,67.69 ; 14.23,85.47 7.37,85.47 NOREF#54.PTH ; 14.23,85.47 14.48,85.47 32.26,67.69 ; NOREF#11.PTH 76.84,67.69 32.26,67.69
L3: length 116.2
  Top Layer w0.254: v1(55.11,16.67) v1(54.6,17.17) 52.57,19.21 52.06,19.21 4.05,67.21 4.05,82.2 NOREF#29.1
  Bottom Layer w0.254: v1(54.6,17.17) v1(55.11,16.67) 60.16,11.61 U1.24
LB: length 98.2
  Top Layer w0.254: NOREF#48.PTH v1(171.84,19.79)
  Bottom Layer w0.254: U1.17 105.59,11.61 109.86,7.34 159.39,7.34 v1(171.84,19.79)
LED1: length 132.1
  Top Layer w0.254: 51.77,74.1 69.55,56.32 69.55,36.25 v1(69.04,35.74) ; 51.77,74.1 51.77,65.46 v1(67.77,49.46) ; 51.77,74.1 50.5,75.37 v1(50.5,80.18) ; 51.77,74.1 51.77,78.92 v1(50.97,79.72)
  Bottom Layer w0.254: v1(69.04,35.74) 68.28,35.74 67.77,35.23 67.77,26.09 69.55,24.31 ; v1(50.5,80.18) 50.5,79.38 U5#14.4 v1(50.97,79.72) ; 69.55,24.31 69.29,24.31 67.26,26.34 67.26,48.95 v1(67.77,49.46) ; 69.55,24.31 U1.29
LEFT: length 152.3
  Top Layer w0.254: v1(55.18,85.06) 55.18,75.15 58.48,71.85 ; 58.48,71.85 58.48,71.09 v1(69.66,59.91) ; 58.48,71.85 v1(58.48,86.33) ; 58.48,71.85 v1(69.66,60.68)
  Bottom Layer w0.254: 70.38,19.23 U1.27 ; 70.38,19.23 70.41,19.23 72.6,21.42 72.6,21.45 ; 70.38,19.23 72.6,21.45 ; 72.6,56.98 72.6,57.74 v1(69.66,60.68) ; 72.6,56.98 72.71,56.87 72.71,21.56 72.6,21.45 ; 72.6,56.98 72.6,21.45 ; 72.6,56.98 v1(69.66,59.91) ; v1(58.48,86.33) 58.23,86.58 U6#3.1 v1(55.18,85.06)
LINEBUTTON01: length 59.3
  Top Layer w0.254: NOREF#36.1 46.17,70.1 67.76,48.51 ; v1(68.78,38.29) 68.78,47.49 67.76,48.51 ; 67.76,48.51 v1(68.01,48.51)
  Bottom Layer w0.254: v1(68.78,38.29) 69.99,37.08 ; 69.99,37.08 U1.34 ; 69.99,37.08 69.54,37.08 68.01,38.6 v1(68.01,48.51)
LINEBUTTON02: length 45.6
  Top Layer w0.254: 70.36,34.67 70.36,70.61 NOREF#58.1 ; 70.36,34.67 v1(68.84,33.15) ; 70.36,34.67 70.36,33.91 v1(69.6,33.15)
  Bottom Layer w0.254: v1(68.84,33.15) 69.6,32.39 ; 69.6,32.39 v1(69.6,33.15) ; 69.6,32.39 U1.32
LINEBUTTON03: length 73.1
  Top Layer w0.254: 78.62,37.97 v1(71.25,30.6) ; 78.62,37.97 78.62,35.43 v1(71.31,28.12) ; 78.62,37.97 78.62,73.78 81.67,76.83 81.67,80.89 NOREF#15.1
  Bottom Layer w0.254: v1(71.31,28.12) 71.31,28.13 U1.31 71.25,30.59 v1(71.25,30.6)
LT: length 92.7
  Bottom Layer w0.254: NOREF#50.PTH 168.57,24.31 U1.12
R3: length 115.4
  Top Layer w0.254: v1(68.08,15.62) 68.33,15.88 68.33,25.9 ; NOREF#34.1 6.86,87.37 68.33,25.9 ; v1(68.84,15.37) 68.84,25.39 68.33,25.9
  Bottom Layer w0.254: v1(68.84,15.37) U1.25 69.55,14.15 v1(68.08,15.62)
RB: length 98.5
  Top Layer w0.254: NOREF#8.PTH 166,30.8 153.3,18.1 151.01,18.1 147.2,14.29 117.48,14.29 113.67,18.1 111.39,18.1 107.58,14.29 v1(102.75,14.29)
  Bottom Layer w0.254: U1.16 90.37,14.29 v1(102.75,14.29)
RIGHT: length 49.1
  Bottom Layer w0.254: U6.1 109.54,75.28 92.52,58.26 92.52,41.33 90.74,39.56 90.23,39.56
RT: length 92
  Bottom Layer w0.254: NOREF#5.PTH 170.18,26.85 U1.11
SELECT: length 111.5
  Top Layer w0.254: v1(70.06,5.26) 69.45,5.86 69.45,30.75 67.44,32.76 67.44,40.89 NOREF#14.1 ; 69.45,6.62 v1(70.82,5.26)
  Bottom Layer w0.254: v1(70.82,5.26) 70.82,4.75 U1.21 v1(70.06,5.26)
START: length 125.8
  Top Layer w0.254: 69.98,30.98 70.06,30.91 70.06,8.56 ; 69.98,30.98 67.95,33.01 67.95,47.49 45.09,70.35 45.09,73.91 NOREF#6.1 ; 69.98,30.98 69.98,8.63 70.06,8.56 ; 70.06,8.56 v1(70.06,7.8) ; 70.06,8.56 v1(70.82,7.8)
  Bottom Layer w0.254: v1(70.82,7.8) 70.82,7.29 U1.22 v1(70.06,7.8)
UP: length 86.8
  Top Layer w0.254: v1(108.26,23.04) 108.77,22.53 109.53,22.53 109.79,22.79 109.79,25.33 v1(91.75,43.36)
  Bottom Layer w0.254: v1(91.75,43.36) 90.48,44.63 U1.4 ; U6#6.1 155.68,23.8 108.77,23.8 108.26,23.3 v1(108.26,23.04)
V: length 125.9
  Bottom Layer w0.254: 28.96,66.67 74.43,66.67 74.94,66.16 ; 28.96,66.67 NOREF#16.PTH ; 28.96,66.67 29.47,66.16 74.94,66.16 ; 74.94,66.16 76.46,64.64 81.29,64.64 82.94,66.29 NOREF#41.PTH
X: length 124.2
  Top Layer w0.254: v1(134.43,42.35) 134.43,51.74 162.87,80.19 v1(163.13,80.19)
  Bottom Layer w0.254: v1(134.43,42.35) 122.74,30.66 88.45,30.66 88.2,30.41 88.2,20.76 89.72,19.23 U1.14 ; U6#7.1 170.29,82.22 167.95,82.22 165.92,80.19 v1(163.13,80.19)
Y: length 100
  Top Layer w0.254: v1(92.59,16.67) 94.11,16.67 95.38,15.4 100.46,15.4 104.02,18.95 114.69,18.95 118.24,15.4 146.69,15.4 149.99,18.7 152.79,18.7 169.04,34.96 NOREF#45.PTH
  Bottom Layer w0.254: v1(92.59,16.67) 90.25,16.67 U1.15

## Copper pours and planes (outline as drawn; the poured copper is in the pictures)
GND on Top Layer: 82.68,100.96 184.41,100.96 184.41,-5.09 82.68,-5.09
GND on Top Layer: -14.47,98.55 87.38,98.55 87.38,-1.15 -14.47,-1.15

## Text on the board
Bottom Layer: G | D+ | D- | V | ci01 | gnd | 3.3v | ci02 | vcc | led3 | ci03 | led21 | led8 | led19 | Y | RB | LB | B | RT | LT | led | Hitboard - GH60 / Designed by 搅局
Top Layer: L3 | R3 | SELECT | START
